# EAGLE schematic CurrentSenseAmpIllustration (EAGLE 9.6.2)
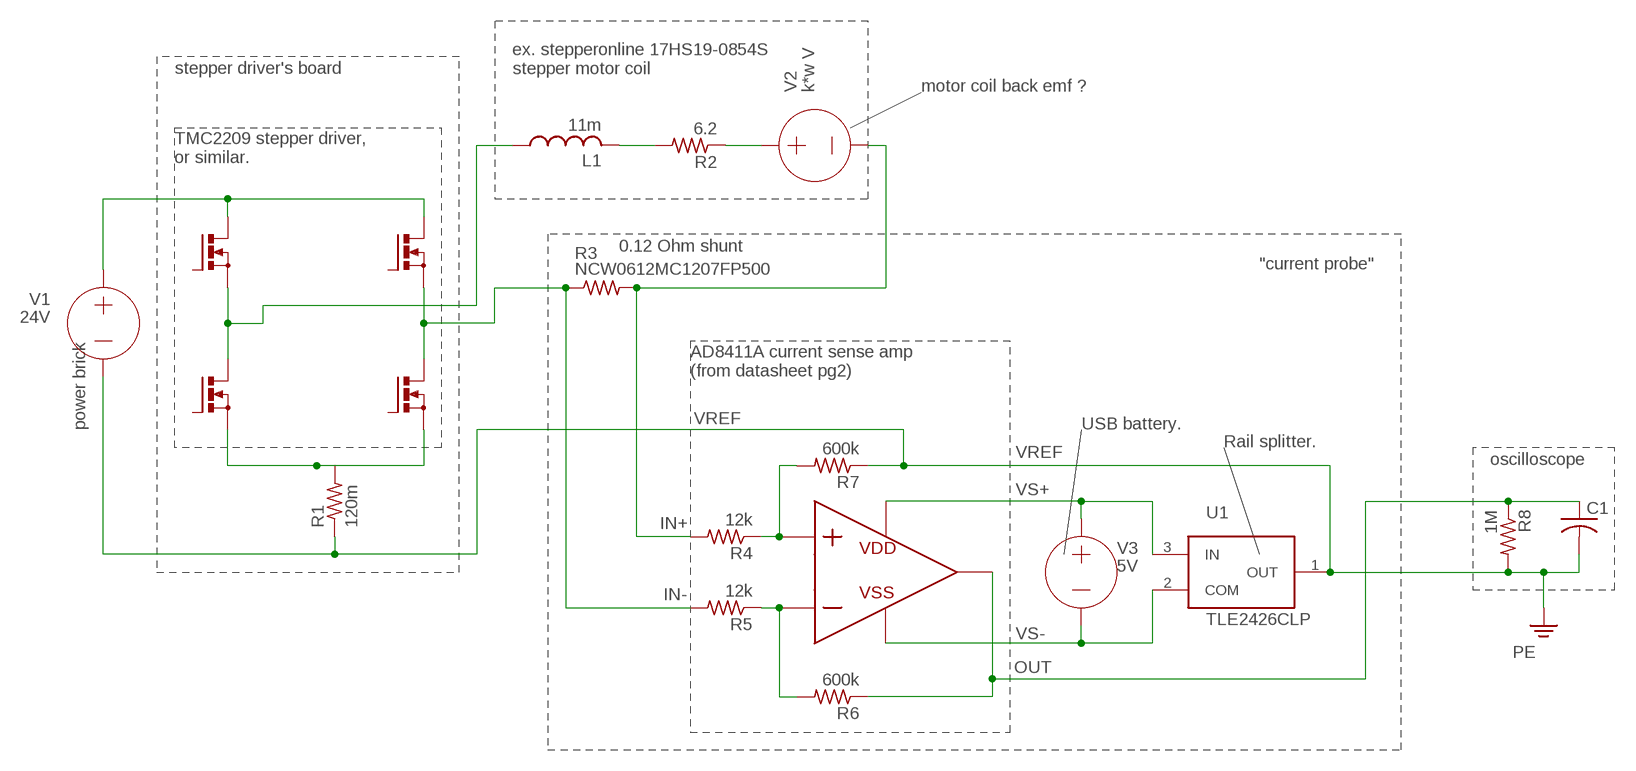
[diagram p0: schematic, sheet 1]

## Parts
C1  C-US050-024X044  [C050-024X044]
L1  11m  L-US0207/10  [0207/10]
R1  120m  R-US_M0805  [M0805]
R2  6.2  R-US_0207/10  [0207/10]
R3  NCW0612MC1207FP500  [R0612]
R4  12k  R-US_0207/10  [0207/10]
R5  12k  R-US_0207/10  [0207/10]
R6  600k  R-US_0207/10  [0207/10]
R7  600k  R-US_0207/10  [0207/10]
R8  1M  R-US_0207/10  [0207/10]
U1  TLE2426CLP  [LP0003A]
V1  24V  VOLTAGE  (no package)
V2  k*w V  VOLTAGE  (no package)
V3  5V  VOLTAGE  (no package)
X1  OPAMP  (no package)

## Nets
N$1: V1.+
N$2: L1.1
N$4: R1.2
N$5: R3.1 R5.2
N$6: L1.2 R2.2
N$7: R2.1 V2.+
N$8: R3.2 R4.2 V2.-
N$9: U1.3(IN) V3.+ X1.VDD
N$10: U1.2(COM) V3.- X1.VSS
N$11: R4.1 R7.2 X1.P
N$12: R5.1 R6.2 X1.N
N$13: C1.1 R6.1 R8.1 X1.VOUT
PE: C1.2 R1.1 R7.1 R8.2 U1.1(OUT) V1.-

## Notes on the sheet
- stepper driver's board
- ex. stepperonline 17HS19-0854S
  stepper motor coil
- motor coil back emf ?
- TMC2209 stepper driver,
  or similar.
- 0.12 Ohm shunt
- "current probe"
- AD8411A current sense amp
  (from datasheet pg2)
- VREF
- power brick | USB battery.
- Rail splitter.
- VREF
- oscilloscope
- VS+
- IN+
- IN-
- VS-
- OUT

## Library data of the parts
C1 = rcl:C-US: CAPACITOR, American symbol; SPICEPREFIX: C
L1 = rcl:L-US: INDUCTOR, American symbol; SPICEPREFIX: L
R1 R2 R4-R8 = rcl:R-US_: RESISTOR, American symbol; SPICEPREFIX: R
R3 = CurrentProbe:NCW?*: Vishay NCW 0406AT / 0612 AT resistors.; RESISTANCE: 0.12
U1 = CurrentProbe:TLE2426: Texas Instruments TLE2426CLP rail splitter, TO-92 package.; TEMP: 0-70
V1-V3 = ngspice-simulation:VOLTAGE: Independent Voltage Source, either DC, AC, PULSE, SINE, PWL, EXP, or SFFM; VALUE: 0V
X1 = ngspice-simulation:OPAMP: Operational amplifier with power pins